# Altium project XC7A35.PrjPcb (part 1 of 5)
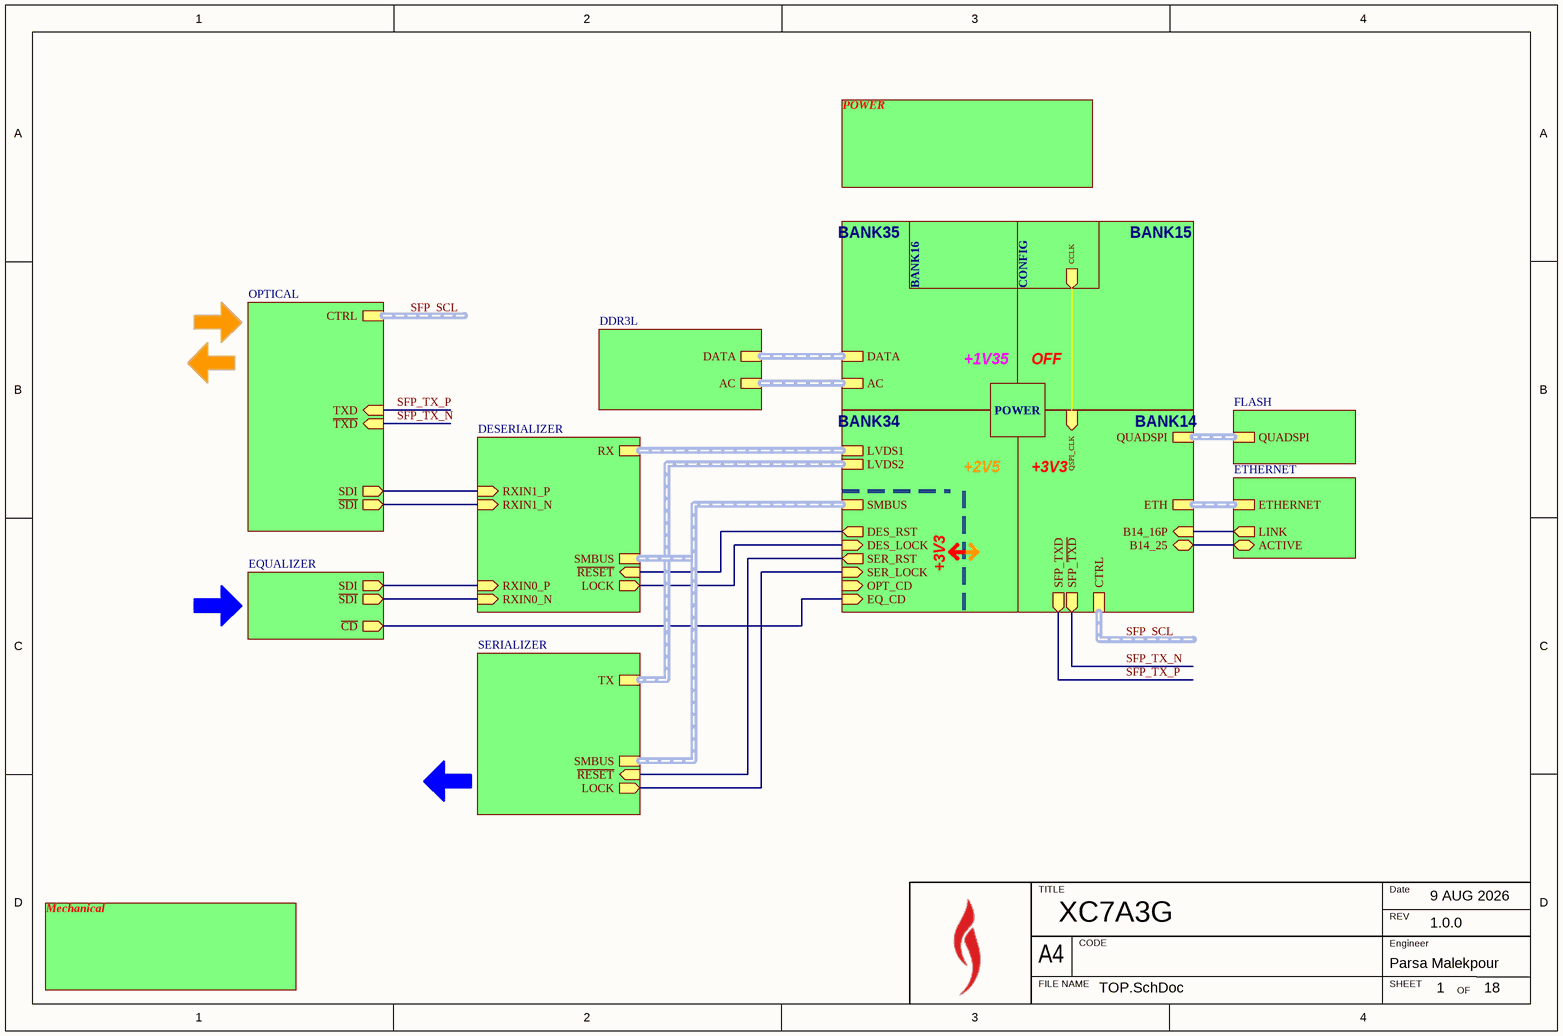
[diagram p0: TOP.SchDoc]
18 sheets, 322 parts. Net scope: hierarchical (ports join the sheet entries above them; power ports are global).
Board file: main.PcbDoc
Sheets:
  TOP.SchDoc
    BANK35 = BANK35.SchDoc
    DDR3L = DDR.SchDoc
    BANK14 = BANK14.SchDoc
    BANK15 = BANK15.SchDoc
    BANK34 = BANK34.SchDoc
    BANK16 = BANK16.SchDoc
    ETHERNET = ETHERNET.SchDoc
    EQUALIZER = EQULIZER.SchDoc
    DESERIALIZER = DESERILIZER.SchDoc
    SERIALIZER = SERIALIZER.SchDoc
    OPTICAL = OPTICS.SchDoc
    POWER = FPGA PWR.SchDoc
    CONFIG = FPGA CONFIG.SchDoc
    FLASH = FLASH.SchDoc
    POWER = POWER.SchDoc
    Mechanical = Mechanical.SchDoc
  Power Diagram.SchDoc

## Sheet TOP.SchDoc: XC7A3G
size A4; Date: 9 AUG 2026; Engineer: Parsa Malekpour; Revision: 1.0.0; SheetNumber: 1; SheetTotal: 18

### Sub-sheets
BANK14 = BANK14.SchDoc: ETH (harness ETHERNET), B14_25 (bidir), B14_16P (in), QUADSPI (harness QUADSPI), QSPI_CLK (in), CTRL (harness SFP_CTRL), SFP_TXD (out), SFP_~{TXD} (out)
BANK15 = BANK15.SchDoc: no entries
BANK16 = BANK16.SchDoc: no entries
BANK34 = BANK34.SchDoc: LVDS1 (harness LVDS), LVDS2 (harness LVDS), SMBUS (harness SMBUS), SER_LOCK (in), OPT_CD (in), DES_RST (out), DES_LOCK (in), SER_RST (out), EQ_CD (in)
BANK35 = BANK35.SchDoc: DATA (harness DDR3_DATA), AC (harness DDR3_AC)
CONFIG = FPGA CONFIG.SchDoc: CCLK (out)
DDR3L = DDR.SchDoc: DATA (harness DDR3_DATA), AC (harness DDR3_AC)
DESERIALIZER = DESERILIZER.SchDoc: RXIN0_N (in), RXIN0_P (in), RXIN1_N (in), RXIN1_P (in), RX (harness LVDS), ~{RESET} (in), LOCK (out), SMBUS (harness SMBUS)
EQUALIZER = EQULIZER.SchDoc: SDI (out), ~{SDI} (out), ~{CD} (out)
ETHERNET = ETHERNET.SchDoc: ETHERNET (harness ETHERNET), LINK (out), ACTIVE (bidir)
FLASH = FLASH.SchDoc: QUADSPI (harness QUADSPI)
Mechanical = Mechanical.SchDoc: no entries
OPTICAL = OPTICS.SchDoc: SDI (out), ~{SDI} (out), CTRL (harness SFP_CTRL), ~{TXD} (in), TXD (in)
POWER = FPGA PWR.SchDoc: no entries
POWER = POWER.SchDoc: no entries
SERIALIZER = SERIALIZER.SchDoc: ~{RESET} (in), TX (harness LVDS), LOCK (out), SMBUS (harness SMBUS)

### Nets
B14_25: sheet BANK14/B14_25, sheet ETHERNET/ACTIVE
DES_LOCK: sheet BANK34/DES_LOCK, sheet DESERIALIZER/LOCK
DES_~{RESET}: sheet BANK34/DES_RST, sheet DESERIALIZER/~{RESET}
EQ_~{CD}: sheet BANK34/EQ_CD, sheet EQUALIZER/~{CD}
EQ_SDO_N: sheet EQUALIZER/~{SDI}, sheet DESERIALIZER/RXIN0_N
EQ_SDO_P: sheet EQUALIZER/SDI, sheet DESERIALIZER/RXIN0_P
ETH_LINK: sheet BANK14/B14_16P, sheet ETHERNET/LINK
OPTIC_TD_N: sheet DESERIALIZER/RXIN1_N, sheet OPTICAL/~{SDI}
OPTIC_TD_P: sheet DESERIALIZER/RXIN1_P, sheet OPTICAL/SDI
SER_LOCK: sheet BANK34/SER_LOCK, sheet SERIALIZER/LOCK
SER_~{RESET}: sheet BANK34/SER_RST, sheet SERIALIZER/~{RESET}
SFP_TX_N: sheet BANK14/SFP_~{TXD}, sheet OPTICAL/~{TXD}
SFP_TX_P: sheet BANK14/SFP_TXD, sheet OPTICAL/TXD
SPI_SCK: sheet BANK14/QSPI_CLK, sheet CONFIG/CCLK

### Buses and harness runs
harness SFP_SCL = sheet BANK14/CTRL
harness SFP_SCL = sheet OPTICAL/CTRL
harness sheet BANK14/ETH = sheet ETHERNET/ETHERNET
harness sheet BANK14/QUADSPI = sheet FLASH/QUADSPI
harness sheet BANK34/LVDS1 = sheet DESERIALIZER/RX
harness sheet BANK34/LVDS2 = sheet SERIALIZER/TX
harness sheet BANK34/SMBUS = sheet DESERIALIZER/SMBUS = sheet SERIALIZER/SMBUS
harness sheet BANK35/AC = sheet DDR3L/AC
harness sheet BANK35/DATA = sheet DDR3L/DATA

### Notes on the sheet
- +1V35
- OFF
- +2V5
- +3V3
- TITLE
- REV
- Date
- A4
- FILE NAME
- CODE
- SHEET
- Engineer
- OF

## Sheet BANK35.SchDoc: XC7A3G-BANK35
size A4; Date: 9 AUG 2026; Engineer: Parsa Malekpour; Revision: 1.0.0; SheetNumber: 6; SheetTotal: 18
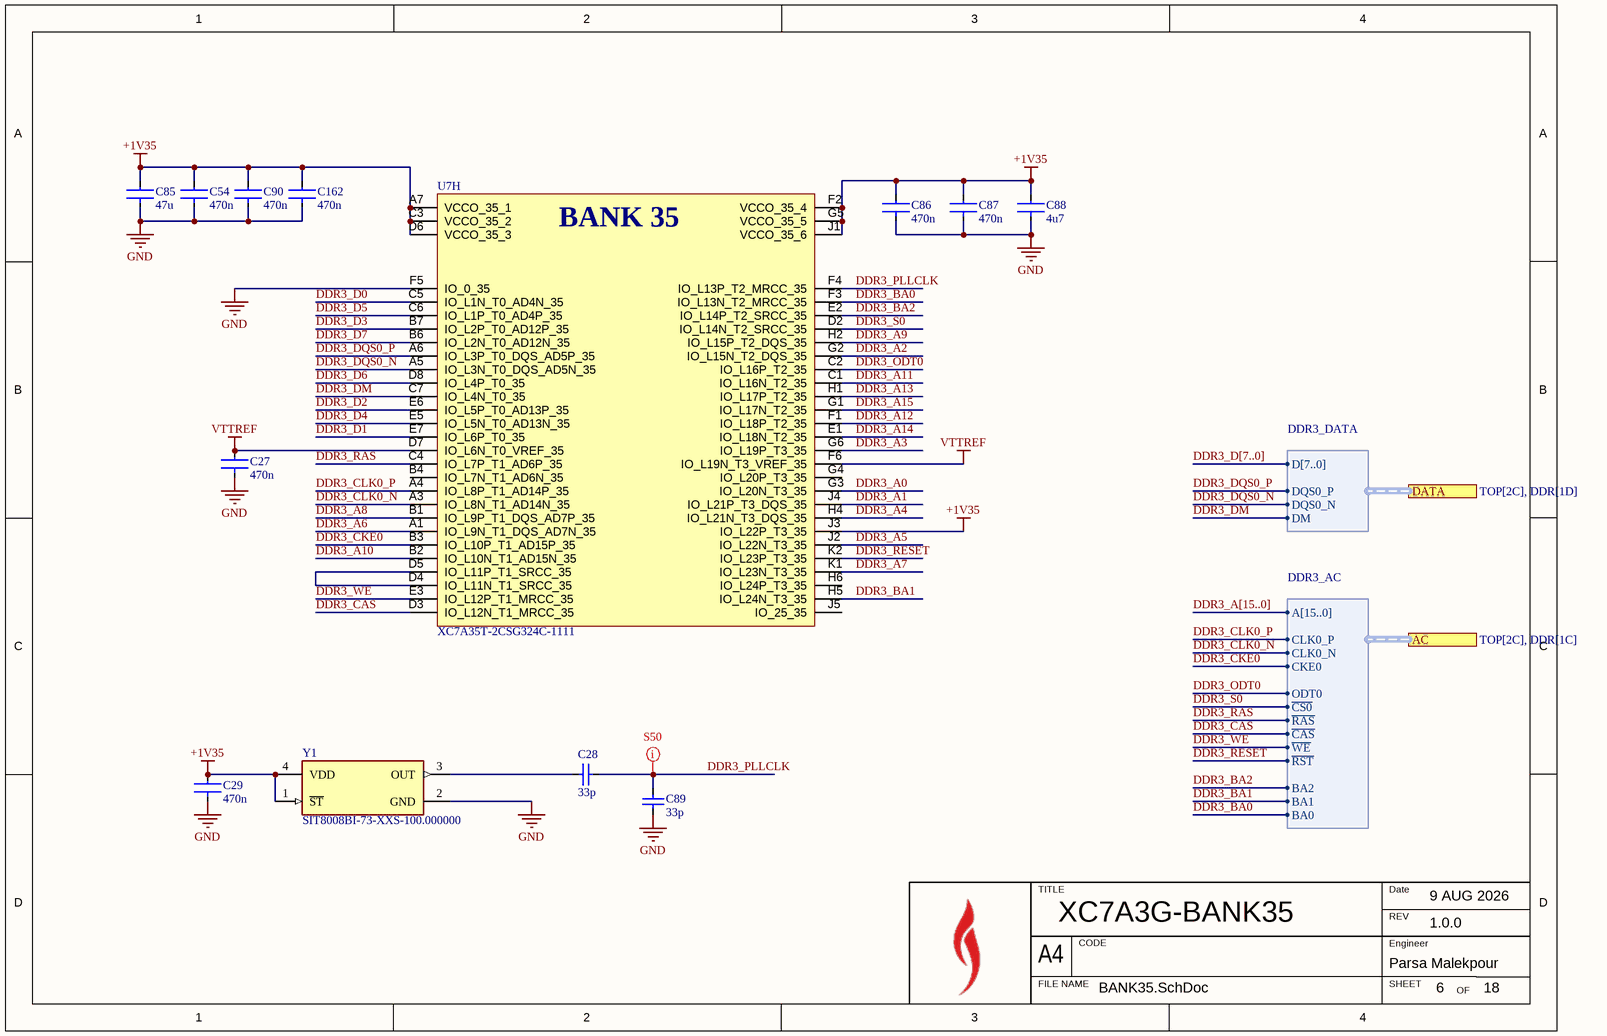
[diagram p1: BANK35.SchDoc]

### Parts
C27  value 470n  [FP-C1005-050-0_05-IPC_C]  (hidden comment: C1005X5R1E474K050BB)
C28  value 33p  [FP-C1005-050-0_05-IPC_C]  (hidden comment: C1005NP01H330J050BA)
C29  value 470n  [FP-C1005-050-0_05-IPC_C]  (hidden comment: C1005X5R1E474K050BB)
C54  value 470n  [FP-C1005-050-0_05-IPC_C]  (hidden comment: C1005X5R1E474K050BB)
C85  value 47u  [FP-C2012-125-0_2-IPC_C]  (hidden comment: C2012X5R1A476M125AC)
C86  value 470n  [FP-C1005-050-0_05-IPC_C]  (hidden comment: C1005X5R1E474K050BB)
C87  value 470n  [FP-C1005-050-0_05-IPC_C]  (hidden comment: C1005X5R1E474K050BB)
C88  value 4u7  [FP-C1005-050-0_20-0_10-IPC_C]  (hidden comment: C1005X5R1A475K050BE)
C89  value 33p  [FP-C1005-050-0_05-IPC_C]  (hidden comment: C1005NP01H330J050BA)
C90  value 470n  [FP-C1005-050-0_05-IPC_C]  (hidden comment: C1005X5R1E474K050BB)
C162  value 470n  [FP-C1005-050-0_05-IPC_C]  (hidden comment: C1005X5R1E474K050BB)
U7  XC7A35T-2CSG324C-1111  [BGA324C80P18X18_1500X1500X150]  (part H of 8)
Y1  SIT8008BI-73-XXS-100.000000  [FP-SiT8008-7-MFG]

### Ports
AC (harness DDR3_AC, see TOP[2C], DDR[1C]), DATA (harness DDR3_DATA, see TOP[2C], DDR[1D])

### Harnesses
DDR3_DATA: D[7..0], DQS0_P, DM, DQS0_N
DDR3_AC: A[15..0], CLK0_P, CKE0, CLK0_N, ODT0, ~{CS0}, ~{RAS}, ~{WE}, ~{CAS}, ~{RST}, BA2, BA1, BA0

### Nets
+1V35: C29.2 C54.2 C85.2 C86.2 C87.2 C88.2 C90.2 C162.2 U7.A7(VCCO_35_1) U7.C3(VCCO_35_2) U7.D6(VCCO_35_3) U7.F2(VCCO_35_4) U7.G5(VCCO_35_5) U7.J1(VCCO_35_6) U7.J3(IO_L22P_T3_35) Y1.1(~{ST}) Y1.4(VDD)
GND: C27.1 C29.1 C54.1 C85.1 C86.1 C87.1 C88.1 C89.1 C90.1 C162.1 U7.F5(IO_0_35) Y1.2(GND)
VTTREF: C27.2 U7.D7(IO_L6N_T0_VREF_35) U7.F6(IO_L19N_T3_VREF_35)
DDR3_A0: U7.G3(IO_L20N_T3_35)
DDR3_A1: U7.J4(IO_L21P_T3_DQS_35)
DDR3_A2: U7.G2(IO_L15N_T2_DQS_35)
DDR3_A3: U7.G6(IO_L19P_T3_35)
DDR3_A4: U7.H4(IO_L21N_T3_DQS_35)
DDR3_A5: U7.J2(IO_L22N_T3_35)
DDR3_A6: U7.A1(IO_L9N_T1_DQS_AD7N_35)
DDR3_A7: U7.K1(IO_L23N_T3_35)
DDR3_A8: U7.B1(IO_L9P_T1_DQS_AD7P_35)
DDR3_A9: U7.H2(IO_L15P_T2_DQS_35)
DDR3_A10: U7.B2(IO_L10N_T1_AD15N_35)
DDR3_A11: U7.C1(IO_L16N_T2_35)
DDR3_A12: U7.F1(IO_L18P_T2_35)
DDR3_A13: U7.H1(IO_L17P_T2_35)
DDR3_A14: U7.E1(IO_L18N_T2_35)
DDR3_A15: U7.G1(IO_L17N_T2_35)
DDR3_BA0: U7.F3(IO_L13N_T2_MRCC_35) ; port AC.BA0
DDR3_BA1: U7.H5(IO_L24N_T3_35) ; port AC.BA1
DDR3_BA2: U7.E2(IO_L14P_T2_SRCC_35) ; port AC.BA2
DDR3_CAS: U7.D3(IO_L12N_T1_MRCC_35) ; port AC.~{CAS}
DDR3_CKE0: U7.B3(IO_L10P_T1_AD15P_35) ; port AC.CKE0
DDR3_CLK0_N: U7.A3(IO_L8N_T1_AD14N_35) ; port AC.CLK0_N
DDR3_CLK0_P: U7.A4(IO_L8P_T1_AD14P_35) ; port AC.CLK0_P
DDR3_D0: U7.C5(IO_L1N_T0_AD4N_35)
DDR3_D1: U7.E7(IO_L6P_T0_35)
DDR3_D2: U7.E6(IO_L5P_T0_AD13P_35)
DDR3_D3: U7.B7(IO_L2P_T0_AD12P_35)
DDR3_D4: U7.E5(IO_L5N_T0_AD13N_35)
DDR3_D5: U7.C6(IO_L1P_T0_AD4P_35)
DDR3_D6: U7.D8(IO_L4P_T0_35)
DDR3_D7: U7.B6(IO_L2N_T0_AD12N_35)
DDR3_DM: U7.C7(IO_L4N_T0_35) ; port DATA.DM
DDR3_DQS0_N: U7.A5(IO_L3N_T0_DQS_AD5N_35) ; port DATA.DQS0_N
DDR3_DQS0_P: U7.A6(IO_L3P_T0_DQS_AD5P_35) ; port DATA.DQS0_P
DDR3_ODT0: U7.C2(IO_L16P_T2_35) ; port AC.ODT0
DDR3_PLLCLK: C28.2 C89.2 U7.F4(IO_L13P_T2_MRCC_35)
DDR3_RAS: U7.C4(IO_L7P_T1_AD6P_35) ; port AC.~{RAS}
DDR3_RESET: U7.K2(IO_L23P_T3_35) ; port AC.~{RST}
DDR3_S0: U7.D2(IO_L14N_T2_SRCC_35) ; port AC.~{CS0}
DDR3_WE: U7.E3(IO_L12P_T1_MRCC_35) ; port AC.~{WE}
NetC28_1: C28.1 Y1.3(OUT)
NetU7_D4: U7.D4(IO_L11N_T1_SRCC_35) U7.D5(IO_L11P_T1_SRCC_35)

Not connected (* = marked no-connect by the designer): U7 B4(IO_L7N_T1_AD6N_35) G4(IO_L20P_T3_35) H6(IO_L24P_T3_35) J5(IO_25_35)

### Buses and harness runs
bus DDR3_A[15..0]
bus DDR3_D[7..0]

### Layout directives
net class S50: DDR3_PLLCLK

### Notes on the sheet
- TITLE
- REV
- Date
- A4
- FILE NAME
- CODE
- SHEET
- Engineer
- OF
- (in symbol XC7A35T-2CSG324C-1111, part H) BANK 35

### Library data of the parts
C27 C29 C54 C86 C87 C90 C162 = CMP-2000-06003-2: Multilayer Ceramic Capacitors 470nF ±10% 25V X5R SMD 0402; Dissipation Factor: 10%; Case Code (Metric): 1005; RoHS Compliant: Yes; Lead Free: Lead Free; Length: 1mm; Case/Package: 0402; Termination: SMD/SMT; Voltage Rating: 25V; Dielectric Material: Ceramic; Dielectric: X5R; Depth: 0.5mm; Series: C; Voltage: 25V; Tolerance: 10%; Packaging: Tape and Reel; Resistor Type: Ceramic; Min Operating Temperature: -55°C; Width: 0.02inch; Thickness: 500um; Package Quantity: 10000; Case Code (Imperial): 0402; Construction: Flat; Height: 0.5mm; REACH SVHC: No SVHC; Radiation Hardening: No; Weight: 2.3E-05oz; Mount: Surface Mount; Voltage Rating (DC): 25V; Max Operating Temperature: 85°C; Part Number: C1005X5R1E474K050BB
C28 C89 = C1005NP01H330J050BA: Multilayer Ceramic Capacitors 33pF ±5% 50V NP0 SMD 0402; Dielectric: C0G; Case Code (Imperial): 0402; Thickness: 0.022inch; Width: 0.02inch; Case Code (Metric): 1005; Length: 0.039inch; Voltage Rating (DC): 50V; Mount: Surface Mount; Max Operating Temperature: 150°C; Height: 0.5mm; Weight: 2.3E-05oz; Voltage Rating: 50V; Case/Package: 0402; Features: High Temperature; Termination: SMD/SMT; Package Quantity: 10000; RoHS Compliant: Yes; Series: C; Tolerance: 5%; Min Operating Temperature: -55°C; Packaging: Tape and Reel; Part Number: C1005NP01H330J050BA
C85 = CMP-2000-05451-2: Multilayer Ceramic Capacitors 47μF ±20% 10V X5R SMD 0805; RoHS Compliant: Yes; Dielectric: X5R; Case Code (Imperial): 0805; Min Operating Temperature: -55°C; Length: 2mm; Voltage Rating: 10V; Lead Free: Lead Free; Weight: 0.000194oz; Resistor Type: Ceramic; Dielectric Material: Ceramic; Max Operating Temperature: 85°C; Height: 1.25mm; Width: 0.049inch; Depth: 1.25mm; Termination: SMD/SMT; Case/Package: 0805; Voltage Rating (DC): 10V; Voltage: 10V; Thickness: 0.057inch; Tolerance: 20%; REACH SVHC: No SVHC; Package Quantity: 1; Series: C; Case Code (Metric): 2012; Mount: Surface Mount; Packaging: Tape and Reel; Part Number: C2012X5R1A476M125AC
C88 = CMP-08246-007228-1: CAP CER 4.7UF 10V X5R 0402; Tolerance: 10%; Max Operating Temperature: 85°C; Case Code (Metric): 1005; Voltage Rating: 10V; Packaging: Tape and Reel; Case/Package: 0402; Features: Soft Termination; Min Operating Temperature: -55°C; Mount: Surface Mount; Case Code (Imperial): 0402; RoHS Compliant: Yes; Part Number: C1005X5R1A475K050BE
U7 = XC7A35T-2CSG324C-1111: Integrated Circuit; Manufacturer_Name: AMD; Datasheet Link: https://www.xilinx.com/support/documentation/data_sheets/ds181_Artix_7_Data_Sheet.pdf; Height: 1.5mm; Manufacturer_Part_Number: XC7A35T-2CSG324C; Mouser Part Number: 217-XC7A35T-2CSG324C; Mouser Price/Stock: https://www.mouser.co.uk/ProductDetail/AMD-Xilinx/XC7A35T-2CSG324C?qs=rrS6PyfT74fMA9%2F3WtPZmw%3D%3D
Y1 = SIT8008BI-73-XXS-100.000000: MEMS OSC XO 100.0000MHZ HCMOS

## Sheet DDR.SchDoc: XC7A3G-LDDR3
size A4; Date: 9 AUG 2026; Engineer: Parsa Malekpour; Revision: 1.0.0; SheetNumber: 10; SheetTotal: 18
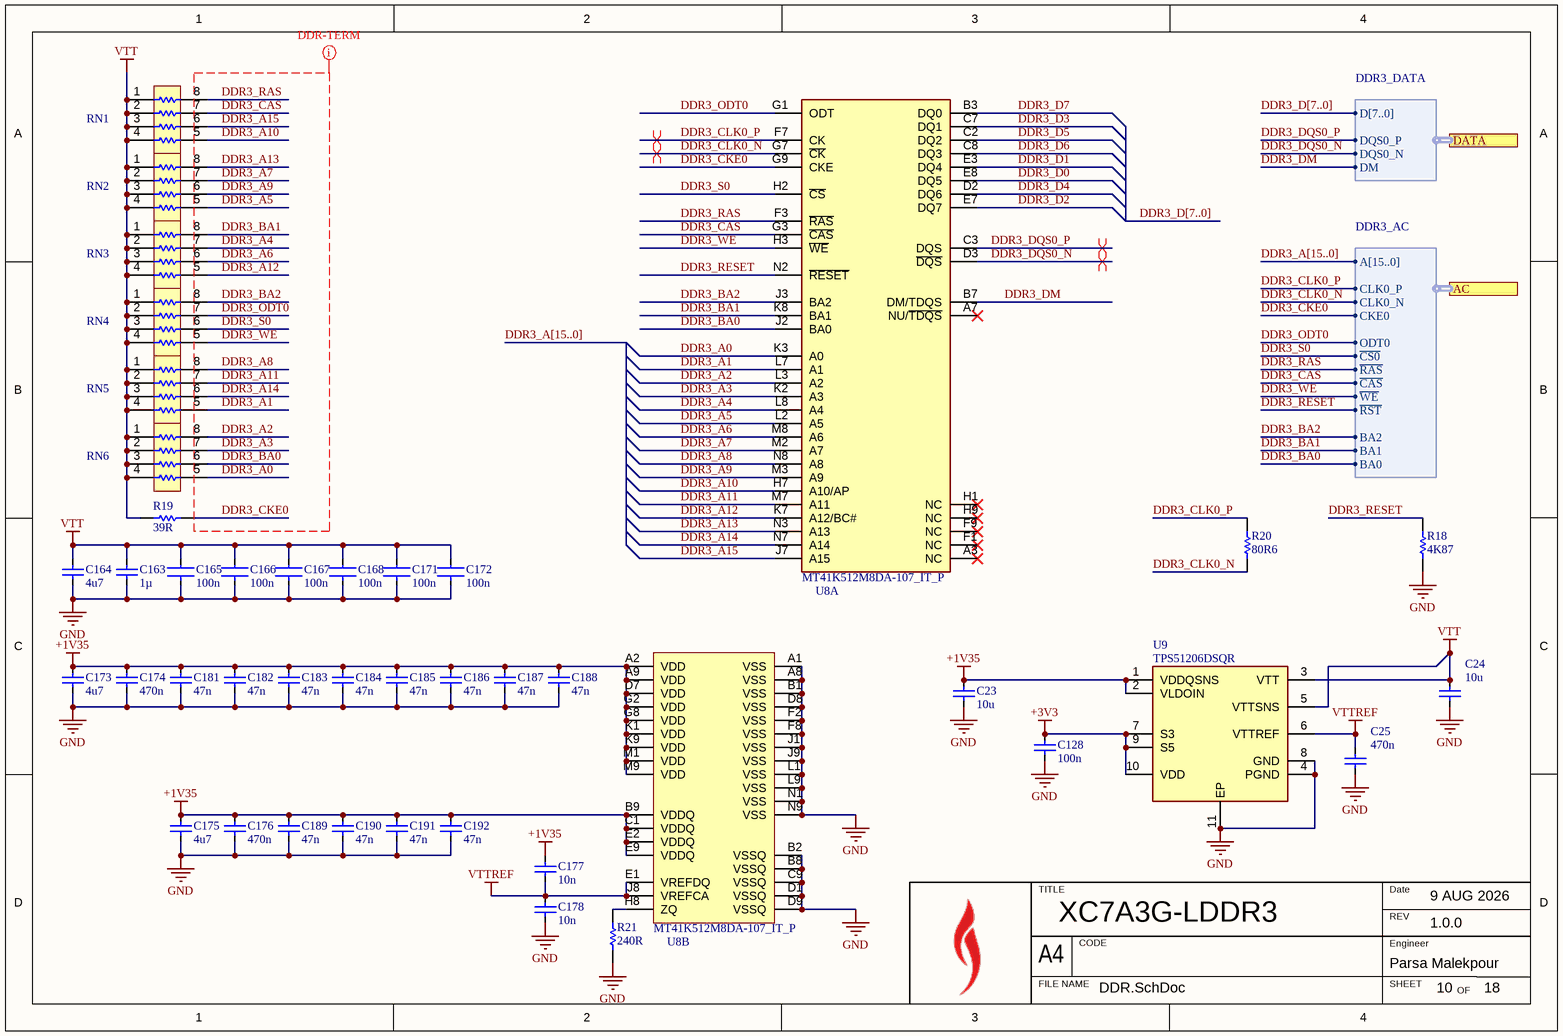
[diagram p2: DDR.SchDoc]

### Parts
C23  value 10u  [FP-C1608-080-0_1-IPC_C]  (hidden comment: C1608JB0J106K080AB)
C24  value 10u  [FP-C1608-080-0_1-IPC_C]  (hidden comment: C1608JB0J106K080AB)
C25  value 470n  [FP-C1005-050-0_05-IPC_C]  (hidden comment: C1005X5R1E474K050BB)
C128  value 100n  [FP-C1005-050-0_05-IPC_C]  (hidden comment: C1005X7R1H104K050BB)
C163  value 1µ  [CAPC1005X55X10NL05]  (hidden comment: C1005X5R1A105K050BB)
C164  value 4u7  [FP-C1005-050-0_20-0_10-IPC_C]  (hidden comment: C1005X5R1A475K050BE)
C165  value 100n  [FP-C1005-050-0_05-IPC_C]  (hidden comment: C1005X7R1H104K050BB)
C166  value 100n  [FP-C1005-050-0_05-IPC_C]  (hidden comment: C1005X7R1H104K050BB)
C167  value 100n  [FP-C1005-050-0_05-IPC_C]  (hidden comment: C1005X7R1H104K050BB)
C168  value 100n  [FP-C1005-050-0_05-IPC_C]  (hidden comment: C1005X7R1H104K050BB)
C171  value 100n  [FP-C1005-050-0_05-IPC_C]  (hidden comment: C1005X7R1H104K050BB)
C172  value 100n  [FP-C1005-050-0_05-IPC_C]  (hidden comment: C1005X7R1H104K050BB)
C173  value 4u7  [FP-C1005-050-0_20-0_10-IPC_C]  (hidden comment: C1005X5R1A475K050BE)
C174  value 470n  [FP-C1005-050-0_05-IPC_C]  (hidden comment: C1005X5R1E474K050BB)
C175  value 4u7  [FP-C1005-050-0_20-0_10-IPC_C]  (hidden comment: C1005X5R1A475K050BE)
C176  value 470n  [FP-C1005-050-0_05-IPC_C]  (hidden comment: C1005X5R1E474K050BB)
C177  value 10n  [FP-C1005-050-0_05-IPC_C]  (hidden comment: C1005X7S2A103K050BB)
C178  value 10n  [FP-C1005-050-0_05-IPC_C]  (hidden comment: C1005X7S2A103K050BB)
C181  value 47n  [FP-C1005-050-0_05-IPC_C]  (hidden comment: C1005X7R1H473K050BB)
C182  value 47n  [FP-C1005-050-0_05-IPC_C]  (hidden comment: C1005X7R1H473K050BB)
C183  value 47n  [FP-C1005-050-0_05-IPC_C]  (hidden comment: C1005X7R1H473K050BB)
C184  value 47n  [FP-C1005-050-0_05-IPC_C]  (hidden comment: C1005X7R1H473K050BB)
C185  value 47n  [FP-C1005-050-0_05-IPC_C]  (hidden comment: C1005X7R1H473K050BB)
C186  value 47n  [FP-C1005-050-0_05-IPC_C]  (hidden comment: C1005X7R1H473K050BB)
C187  value 47n  [FP-C1005-050-0_05-IPC_C]  (hidden comment: C1005X7R1H473K050BB)
C188  value 47n  [FP-C1005-050-0_05-IPC_C]  (hidden comment: C1005X7R1H473K050BB)
C189  value 47n  [FP-C1005-050-0_05-IPC_C]  (hidden comment: C1005X7R1H473K050BB)
C190  value 47n  [FP-C1005-050-0_05-IPC_C]  (hidden comment: C1005X7R1H473K050BB)
C191  value 47n  [FP-C1005-050-0_05-IPC_C]  (hidden comment: C1005X7R1H473K050BB)
C192  value 47n  [FP-C1005-050-0_05-IPC_C]  (hidden comment: C1005X7R1H473K050BB)
R18  value 4K87  [RESC1005X40X25LL05T10]  (hidden comment: RC0402FR-074K87L)
R19  value 39R  [RESC1005X40X25LL05T10]  (hidden comment: RC0402FR-0739RL)
R20  value 80R6  [RESC1005X40X25LL05T10]  (hidden comment: RC0402FR-0780R6L)
R21  value 240R  [RESC1005X40X25LL05T10]  (hidden comment: RC0402FR-07240RL)
RN1  (no value)  [TC124FR0739RL]
RN2  (no value)  [TC124FR0739RL]
RN3  (no value)  [TC124FR0739RL]
RN4  (no value)  [TC124FR0739RL]
RN5  (no value)  [TC124FR0739RL]
RN6  (no value)  [TC124FR0739RL]
U8  MT41K512M8DA-107_IT_P  [BGA78C80P9X13_800X1050X120]  (parts A,B of 2)
U9  TPS51206DSQR  [SON40P200X200X80-11N]

### Ports
AC (harness DDR3_AC, see TOP[3C], BANK35[1B]), DATA (harness DDR3_DATA, see TOP[3C], BANK35[1C])

### Harnesses
DDR3_DATA: D[7..0], DQS0_P, DM, DQS0_N
DDR3_AC: A[15..0], CLK0_P, CKE0, CLK0_N, ODT0, ~{CS0}, ~{RAS}, ~{WE}, ~{CAS}, ~{RST}, BA2, BA1, BA0

### Nets
+1V35: C23.1 C173.1 C174.1 C175.1 C176.1 C177.1 C181.1 C182.1 C183.1 C184.1 C185.1 C186.1 C187.1 C188.1 C189.1 C190.1 C191.1 C192.1 U8.A2(VDD) U8.A9(VDD) U8.B9(VDDQ) U8.C1(VDDQ) U8.D7(VDD) U8.E2(VDDQ) U8.E9(VDDQ) U8.G2(VDD) U8.G8(VDD) U8.K1(VDD) U8.K9(VDD) U8.M1(VDD) U8.M9(VDD) U9.1(VDDQSNS) U9.2(VLDOIN)
+3V3: C128.1 U9.7(S3) U9.9(S5) U9.10(VDD)
GND: C23.2 C24.1 C25.1 C128.2 C163.2 C164.2 C165.1 C166.1 C167.1 C168.1 C171.1 C172.1 C173.2 C174.2 C175.2 C176.2 C178.2 C181.2 C182.2 C183.2 C184.2 C185.2 C186.2 C187.2 C188.2 C189.2 C190.2 C191.2 C192.2 R18.1 R21.2 U8.A1(VSS) U8.A8(VSS) U8.B1(VSS) U8.B2(VSSQ) U8.B8(VSSQ) U8.C9(VSSQ) U8.D1(VSSQ) U8.D8(VSS) U8.D9(VSSQ) U8.F2(VSS) U8.F8(VSS) U8.J1(VSS) U8.J9(VSS) U8.L1(VSS) U8.L9(VSS) U8.N1(VSS) U8.N9(VSS) U9.4(PGND) U9.8(GND) U9.11(EP)
VTT: C24.2 C163.1 C164.1 C165.2 C166.2 C167.2 C168.2 C171.2 C172.2 R19.1 RN1.1 RN1.2 RN1.3 RN1.4 RN2.1 RN2.2 RN2.3 RN2.4 RN3.1 RN3.2 RN3.3 RN3.4 RN4.1 RN4.2 RN4.3 RN4.4 RN5.1 RN5.2 RN5.3 RN5.4 RN6.1 RN6.2 RN6.3 RN6.4 U9.3(VTT) U9.5(VTTSNS)
VTTREF: C25.2 C177.2 C178.1 U8.E1(VREFDQ) U8.J8(VREFCA) U9.6(VTTREF)
DDR3_A0: RN6.5 U8.K3(A0)
DDR3_A1: RN5.5 U8.L7(A1)
DDR3_A2: RN6.8 U8.L3(A2)
DDR3_A3: RN6.7 U8.K2(A3)
DDR3_A4: RN3.7 U8.L8(A4)
DDR3_A5: RN2.5 U8.L2(A5)
DDR3_A6: RN3.6 U8.M8(A6)
DDR3_A7: RN2.7 U8.M2(A7)
DDR3_A8: RN5.8 U8.N8(A8)
DDR3_A9: RN2.6 U8.M3(A9)
DDR3_A10: RN1.5 U8.H7(A10/AP)
DDR3_A11: RN5.7 U8.M7(A11)
DDR3_A12: RN3.5 U8.K7(A12/BC#)
DDR3_A13: RN2.8 U8.N3(A13)
DDR3_A14: RN5.6 U8.N7(A14)
DDR3_A15: RN1.6 U8.J7(A15)
DDR3_BA0: RN6.6 U8.J2(BA0) ; port AC.BA0
DDR3_BA1: RN3.8 U8.K8(BA1) ; port AC.BA1
DDR3_BA2: RN4.8 U8.J3(BA2) ; port AC.BA2
DDR3_CAS: RN1.7 U8.G3(~{CAS}) ; port AC.~{CAS}
DDR3_CKE0: R19.2 U8.G9(CKE) ; port AC.CKE0
DDR3_CLK0_N: R20.2 U8.G7(~{CK}) ; port AC.CLK0_N
DDR3_CLK0_P: R20.1 U8.F7(CK) ; port AC.CLK0_P
DDR3_D0: U8.E8(DQ5)
DDR3_D1: U8.E3(DQ4)
DDR3_D2: U8.E7(DQ7)
DDR3_D3: U8.C7(DQ1)
DDR3_D4: U8.D2(DQ6)
DDR3_D5: U8.C2(DQ2)
DDR3_D6: U8.C8(DQ3)
DDR3_D7: U8.B3(DQ0)
DDR3_DM: U8.B7(DM/TDQS) ; port DATA.DM
DDR3_DQS0_N: U8.D3(~{DQS}) ; port DATA.DQS0_N
DDR3_DQS0_P: U8.C3(DQS) ; port DATA.DQS0_P
DDR3_ODT0: RN4.7 U8.G1(ODT) ; port AC.ODT0
DDR3_RAS: RN1.8 U8.F3(~{RAS}) ; port AC.~{RAS}
DDR3_RESET: R18.2 U8.N2(~{RESET}) ; port AC.~{RST}
DDR3_S0: RN4.6 U8.H2(~{CS}) ; port AC.~{CS0}
DDR3_WE: RN4.5 U8.H3(~{WE}) ; port AC.~{WE}
NetR21_1: R21.1 U8.H8(ZQ)

Not connected (* = marked no-connect by the designer): U8 A3(NC)* A7(NU/~{TDQS})* F1(NC)* F9(NC)* H1(NC)* H9(NC)*

### Buses and harness runs
bus DDR3_A[15..0]
bus DDR3_D[7..0]

### Layout directives
differential pair: DDR3_CLK0_N, DDR3_CLK0_P, DDR3_DQS0_N, DDR3_DQS0_P
net class DDR-TERM: DDR3_A0, DDR3_A1, DDR3_A2, DDR3_A3, DDR3_A4, DDR3_A5, DDR3_A6, DDR3_A7, DDR3_A8, DDR3_A9, DDR3_A10, DDR3_A11, DDR3_A12, DDR3_A13, DDR3_A14, DDR3_A15, DDR3_BA0, DDR3_BA1, DDR3_BA2, DDR3_CAS, DDR3_CKE0, DDR3_ODT0, DDR3_RAS, DDR3_S0, DDR3_WE

### Notes on the sheet
- TITLE
- REV
- Date
- A4
- FILE NAME
- CODE
- SHEET
- Engineer
- OF

### Library data of the parts
C23 C24 = C1608JB0J106K080AB: MLCC 10μF ±10% 6.3V JB SMD 0603; Dielectric Material: Ceramic; Case Code (Imperial): 0603; Thickness: 0.035inch; Min Operating Temperature: -25°C; Termination: SMD/SMT; Lead Free: Lead Free; Resistor Type: Ceramic; Width: 0.8mm; Voltage Rating (DC): 6.3V; Package Quantity: 4000; Tolerance: 10%; Length: 0.063inch; Series: C; Height: 0.8mm; Max Operating Temperature: 85°C; Mount: Surface Mount; RoHS Compliant: Yes; Voltage Rating: 6.3V; Case Code (Metric): 1608; Case/Package: 0603; Packaging: Tape and Reel
C25 = C1005X5R1E474K050BB: MLCC 470nF ±10% 25V X5R SMD 0402; Dielectric Material: Ceramic; Dissipation Factor: 10%; Case Code (Metric): 1005; RoHS Compliant: Yes; Lead Free: Lead Free; Length: 1mm; Case/Package: 0402; Termination: SMD/SMT; Voltage Rating: 25V; Dielectric: X5R; Depth: 0.5mm; Series: C; Voltage: 25V; Tolerance: 10%; Packaging: Tape and Reel; Resistor Type: Ceramic; Min Operating Temperature: -55°C; Width: 0.02inch; Thickness: 500um; Package Quantity: 10000; Case Code (Imperial): 0402; Construction: Flat; Height: 0.5mm; REACH SVHC: No SVHC; Radiation Hardening: No; Weight: 2.3E-05oz; Mount: Surface Mount; Voltage Rating (DC): 25V; Max Operating Temperature: 85°C; Part Number: C1005X5R1E474K050BB
C128 = C1005X7R1H104K050BB: MLCC 100nF ±10% 50V X7R SMD 0402; Dielectric Material: Ceramic; Voltage: 50V; Min Operating Temperature: -55°C; Depth: 0.5mm; Radiation Hardening: No; RoHS Compliant: Yes; Voltage Rating (DC): 50V; Lead Free: Lead Free; Resistor Type: Ceramic; Height: 0.5mm; Dielectric: X7R; Thickness: 0.022inch; Case/Package: 0402; Case Code (Metric): 1005; Termination: SMD/SMT; Packaging: Tape and Reel; Max Operating Temperature: 125°C; Mount: Surface Mount; Package Quantity: 1; Width: 0.02inch; Weight: 2.3E-05oz; Voltage Rating: 50V; Tolerance: 10%; Construction: Flat; Case Code (Imperial): 0402; Length: 1mm; REACH SVHC: No SVHC; Series: C; Part Number: C1005X7R1H104K050BB
C163 = C1005X5R1A105K050BB: Multilayer Ceramic Chip Capacitor, 1 uF, +/- 10%, 10 V, -55 to 85 degC, 0402 (1005 Metric), RoHS, Tape and Reel; Manufacturer: TDK; PCN Part Number: MLCCPartNumberChange30/Nov/2012; Product Training Modules: CSeriesGeneralApplicationsSEAT,CCV,andTVCLDesignToolsGuidetoReplacinganElectrolyticCapacitorwithanMLCC; Voltage - Rated: 10V; Temperature Coefficient: X5R; Online Catalog: CSeries,GeneralPurpose; Other Names: 445-4114-6; Category: Capacitors; Features: -; Lead Style: -; RoHS Information: RoHSCertificate-MLCC; Manufacturer URL: http://www.tdk.com/; Lead Spacing: -; Thickness (Max): 0.022"(0.55mm); Applications: GeneralPurpose; Tolerance: ±10%; Mounting Technology: SurfaceMount; Mounting Type: SurfaceMount,MLCC; Operating Temperature: -55°C~85°C; Datasheet URL: http://download.siliconexpert.com/pdfs/2015/4/21/15/54/45/779/tdk_/manual/37024850441143360mlcc_commercial_general_en.pdf; Package Reference: 1005; Height - Seated (Max): -; Family: CeramicCapacitors; Datasheet Version: 03/2015; Package Description: 2-Pin Surface Mount Device, Body 1 x 0.5 mm; Packaging: Digi-Reel®; Size / Dimension: 0.039"Lx0.020"W(1.00mmx0.50mm); Standard Package: 1; Package / Case: 0402(1005Metric); Ratings: -; Series: C; Part Number: C1005X5R1A105K050BB
C164 C173 C175 = C1005X5R1A475K050BE: CAP CER 4.7UF 10V X5R 0402; Tolerance: 10%; Max Operating Temperature: 85°C; Case Code (Metric): 1005; Voltage Rating: 10V; Packaging: Tape and Reel; Case/Package: 0402; Features: Soft Termination; Min Operating Temperature: -55°C; Mount: Surface Mount; Case Code (Imperial): 0402; RoHS Compliant: Yes; Part Number: C1005X5R1A475K050BE
C165-C168 C171 C172 = CMP-2000-05393-2: Multilayer Ceramic Capacitors 100nF ±10% 50V X7R SMD 0402; Voltage: 50V; Dielectric Material: Ceramic; Min Operating Temperature: -55°C; Depth: 0.5mm; Radiation Hardening: No; RoHS Compliant: Yes; Voltage Rating (DC): 50V; Lead Free: Lead Free; Resistor Type: Ceramic; Height: 0.5mm; Dielectric: X7R; Thickness: 0.022inch; Case/Package: 0402; Case Code (Metric): 1005; Termination: SMD/SMT; Packaging: Tape and Reel; Max Operating Temperature: 125°C; Mount: Surface Mount; Package Quantity: 1; Width: 0.02inch; Weight: 2.3E-05oz; Voltage Rating: 50V; Tolerance: 10%; Construction: Flat; Case Code (Imperial): 0402; Length: 1mm; REACH SVHC: No SVHC; Series: C; Part Number: C1005X7R1H104K050BB
C174 C176 = C1005X5R1E474K050BB: Multilayer Ceramic Capacitors 470nF ±10% 25V X5R SMD 0402; Dissipation Factor: 10%; Case Code (Metric): 1005; RoHS Compliant: Yes; Lead Free: Lead Free; Length: 1mm; Case/Package: 0402; Termination: SMD/SMT; Dielectric Material: Ceramic; Dielectric: X5R; Depth: 0.5mm; Series: C; Voltage: 25V; Tolerance: 10%; Packaging: Tape and Reel; Resistor Type: Ceramic; Min Operating Temperature: -55°C; Width: 0.02inch; Thickness: 500um; Package Quantity: 10000; Case Code (Imperial): 0402; Construction: Flat; Height: 0.5mm; REACH SVHC: No SVHC; Radiation Hardening: No; Weight: 2.3E-05oz; Mount: Surface Mount; Voltage Rating (DC): 25V; Max Operating Temperature: 85°C; Part Number: C1005X5R1E474K050BB; Voltage Rating: 25V
C177 C178 = C1005X7S2A103K050BB: Multilayer Ceramic Capacitors 10nF ±10% 100V X7S SMD 0402; Dissipation Factor: 5%; Case Code (Imperial): 0402; Packaging: Tape and Reel; Voltage Rating (DC): 100V; Max Operating Temperature: 125°C; Min Operating Temperature: -55°C; Case Code (Metric): 1005; Weight: 2.3E-05oz; Length: 1mm; Width: 0.02inch; Tolerance: 10%; Series: C; Package Quantity: 1; RoHS Compliant: Yes; Voltage: 100V; Resistor Type: Ceramic; Number of Pins: 2; Mount: Surface Mount; Height: 0.5mm; Termination: SMD/SMT; Dielectric: X7S; Dielectric Material: Ceramic; Thickness: 0.022inch; REACH SVHC: No SVHC; Lead Free: Lead Free; Voltage Rating: 100V; Case/Package: 0402; Depth: 0.5mm; Part: *; Part Number: C1005X7S2A103K050BB
C181-C192 = C1005X7R1H473K050BB: Multilayer Ceramic Capacitors 47nF ±10% 50V X7R SMD 0402; Dissipation Factor: 5%; Weight: 2.3E-05oz; Max Operating Temperature: 125°C; Package Quantity: 1; Width: 0.02inch; Min Operating Temperature: -55°C; Length: 1mm; Dielectric: X7R; Voltage Rating: 50V; Number of Pins: 2; Lead Free: Lead Free; Voltage: 50V; Dielectric Material: Ceramic; Height: 0.5mm; Case Code (Metric): 1005; Voltage Rating (DC): 50V; Construction: Flat; Termination: SMD/SMT; Case Code (Imperial): 0402; Depth: 0.5mm; Packaging: Tape and Reel; Mount: Surface Mount; Series: C; RoHS Compliant: Yes; Tolerance: 10%; Case/Package: 0402; Thickness: 0.022inch; Radiation Hardening: No; Resistor Type: Ceramic; REACH SVHC: No SVHC; Part Number: C1005X7R1H473K050BB
R18 = RC0402FR-074K87L: Manufacturer: Yageo / Phycomp; Part Number: RC0402FR-074K87L
R19 = RC0402FR-0739RL: Manufacturer: Yageo / Phycomp; Part Number: RC0402FR-0739RL; Parameter 1: *
R20 = RC0402FR-0780R6L: Manufacturer: Yageo; Part Number: RC0402FR-0780R6L; Parameter 1: *
R21 = RC0402FR-07240RL: 240R 0.063W 1% 0402 (1005 Metric)  SMD; Case-Metric: 1005; Case-EIA: 0402; Power: 0.063 W; Tolerance: 1 %; Technology: SMT; Part Number: RC0402FR-07240RL; Parameter 1: *
RN1-RN6 = TC124-FR-0739RL: Resistor Network; Manufacturer_Name: Yageo Group; Datasheet Link: https://media.digikey.com/pdf/Data%20Sheets/Yageo%20PDFs/YC102-358,TC122-164_Series_DS.pdf; Height: 0.5mm; Part Number: TC124-FR-0739RL; Mouser Part Number: 603-TC124-FR-0739RL; Mouser Price/Stock: https://www.mouser.co.uk/ProductDetail/Yageo/TC124-FR-0739RL?qs=k2KEx2DUIRQSySNVqUaapQ%3D%3D; Arrow Part Number: TC124-FR-0739RL; Arrow Price/Stock: null?region=nac
U8 = MT41K512M8DA-107_IT_P: Integrated Circuit; Manufacturer_Name: Micron; Manufacturer_Part_Number: MT41K512M8DA-107 IT:P; Datasheet Link: https://datasheet.datasheetarchive.com/originals/distributors/DKDS42/DSANUWW0045409.pdf; Height: 1.2mm; Mouser Part Number: 340-265832-TRAY; Mouser Price/Stock: https://www.mouser.co.uk/ProductDetail/Micron/MT41K512M8DA-107-ITP?qs=rrS6PyfT74e6FNRbiIMwlg%3D%3D; Arrow Part Number: MT41K512M8DA-107 IT:P; Arrow Price/Stock: https://www.arrow.com/en/products/mt41k512m8da-107-itp/micron-technology?region=europe
U9 = TPS51206DSQR: Integrated Circuit; Manufacturer_Name: Texas Instruments; Datasheet Link: http://www.ti.com/lit/ds/symlink/tps51206.pdf; Height: 0.8mm; Manufacturer_Part_Number: TPS51206DSQR; Mouser Part Number: 595-TPS51206DSQR; Mouser Price/Stock: https://www.mouser.co.uk/ProductDetail/Texas-Instruments/TPS51206DSQR?qs=%252BG2H6gVb6ixLbD%2FQxTGyiQ%3D%3D; Arrow Part Number: TPS51206DSQR; Arrow Price/Stock: https://www.arrow.com/en/products/tps51206dsqr/texas-instruments?region=nac

## Sheet BANK14.SchDoc: XC7A3G - BANK14
size A4; Date: 9 AUG 2026; Engineer: Parsa Malekpour; Revision: 1.0.0; SheetNumber: 2; SheetTotal: 18
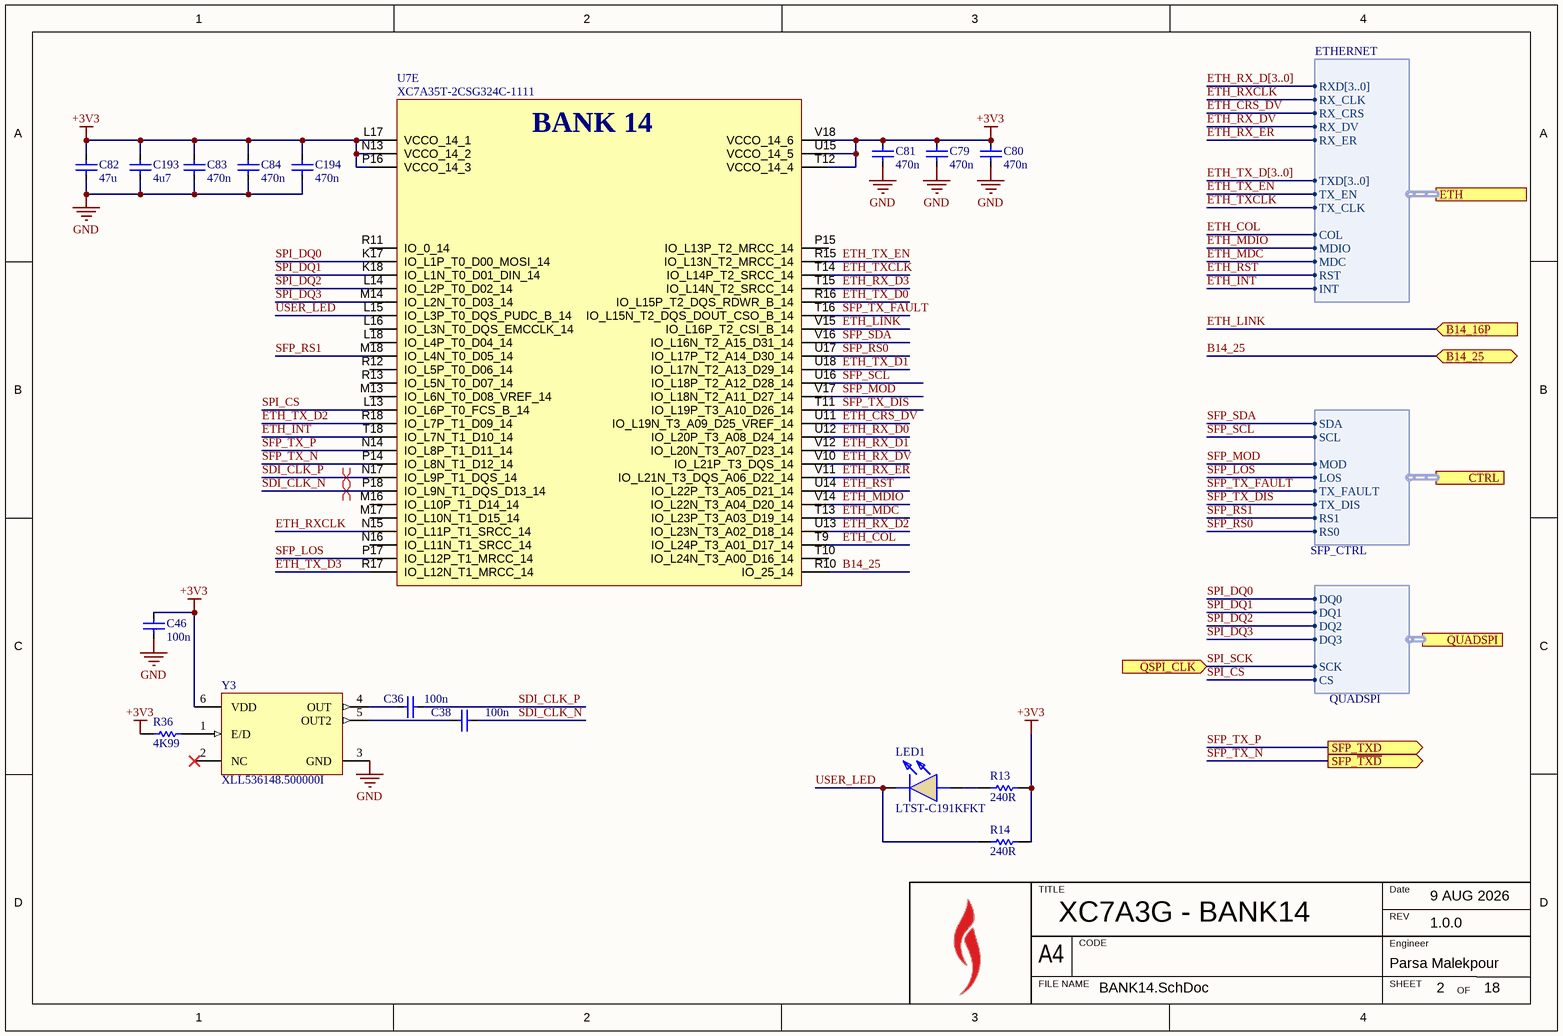
[diagram p3: BANK14.SchDoc]

### Parts
C36  value 100n  [FP-C1005-050-0_05-IPC_C]  (hidden comment: C1005X7R1H104K050BB)
C38  value 100n  [FP-C1005-050-0_05-IPC_C]  (hidden comment: C1005X7R1H104K050BB)
C46  value 100n  [FP-C1005-050-0_05-IPC_C]  (hidden comment: C1005X7R1H104K050BB)
C79  value 470n  [FP-C1005-050-0_05-IPC_C]  (hidden comment: C1005X5R1E474K050BB)
C80  value 470n  [FP-C1005-050-0_05-IPC_C]  (hidden comment: C1005X5R1E474K050BB)
C81  value 470n  [FP-C1005-050-0_05-IPC_C]  (hidden comment: C1005X5R1E474K050BB)
C82  value 47u  [FP-C2012-125-0_2-IPC_C]  (hidden comment: C2012X5R1A476M125AC)
C83  value 470n  [FP-C1005-050-0_05-IPC_C]  (hidden comment: C1005X5R1E474K050BB)
C84  value 470n  [FP-C1005-050-0_05-IPC_C]  (hidden comment: C1005X5R1E474K050BB)
C193  value 4u7  [FP-C1005-050-0_20-0_10-IPC_C]  (hidden comment: C1005X5R1A475K050BE)
C194  value 470n  [FP-C1005-050-0_05-IPC_C]  (hidden comment: C1005X5R1E474K050BB)
LED1  LTST-C191KFKT  [LEDC1608X55N]
R13  value 240R  [RESC1005X40X25LL05T10]  (hidden comment: RC0402FR-07240RL)
R14  value 240R  [RESC1005X40X25LL05T10]  (hidden comment: RC0402FR-07240RL)
R36  value 4K99  [RESC1005X40X25LL05T10]  (hidden comment: RC0402FR-074K99L)
U7  XC7A35T-2CSG324C-1111  [BGA324C80P18X18_1500X1500X150]  (part E of 8)
Y3  XLL536148.500000I  [JS6_MFG]

### Ports
B14_16P (in, see TOP[1B]), B14_25 (bidir, see TOP[1B]), CTRL (harness SFP_CTRL, see TOP[2B], OPTICS[1B]), ETH (harness ETHERNET, see TOP[1C]), QSPI_CLK (in, see TOP[2C]), QUADSPI (harness QUADSPI, see TOP[1C], FLASH[3B]), SFP_TXD (out, see TOP[2B]), SFP_~{TXD} (out, see TOP[2B])

### Harnesses
ETHERNET: RXD[3..0], TXD[3..0], TX_EN, TX_CLK, RX_CLK, RX_CRS, RX_DV, COL, RX_ER, MDIO, MDC, RST, INT
QUADSPI: DQ0, DQ1, DQ2, DQ3, SCK, CS
SFP_CTRL: RS0, RS1, TX_DIS, TX_FAULT, LOS, MOD, SCL, SDA

### Nets
+3V3: C46.2 C79.1 C80.1 C81.1 C82.1 C83.1 C84.1 C193.1 C194.1 R13.2 R14.2 R36.1 U7.L17(VCCO_14_1) U7.N13(VCCO_14_2) U7.P16(VCCO_14_3) U7.T12(VCCO_14_4) U7.U15(VCCO_14_5) U7.V18(VCCO_14_6) Y3.6(VDD)
GND: C46.1 C79.2 C80.2 C81.2 C82.2 C83.2 C84.2 C193.2 C194.2 Y3.3(GND)
B14_25: U7.R10(IO_25_14) ; port B14_25
ETH_COL: U7.T9(IO_L24P_T3_A01_D17_14) ; port ETH.COL
ETH_CRS_DV: U7.U11(IO_L19N_T3_A09_D25_VREF_14) ; port ETH.RX_CRS
ETH_INT: U7.T18(IO_L7N_T1_D10_14) ; port ETH.INT
ETH_LINK: U7.V15(IO_L16P_T2_CSI_B_14) ; port B14_16P
ETH_MDC: U7.T13(IO_L23P_T3_A03_D19_14) ; port ETH.MDC
ETH_MDIO: U7.V14(IO_L22N_T3_A04_D20_14) ; port ETH.MDIO
ETH_RST: U7.U14(IO_L22P_T3_A05_D21_14) ; port ETH.RST
ETH_RX_D0: U7.U12(IO_L20P_T3_A08_D24_14)
ETH_RX_D1: U7.V12(IO_L20N_T3_A07_D23_14)
ETH_RX_D2: U7.U13(IO_L23N_T3_A02_D18_14)
ETH_RX_D3: U7.T15(IO_L14N_T2_SRCC_14)
ETH_RX_DV: U7.V10(IO_L21P_T3_DQS_14) ; port ETH.RX_DV
ETH_RX_ER: U7.V11(IO_L21N_T3_DQS_A06_D22_14) ; port ETH.RX_ER
ETH_RXCLK: U7.N15(IO_L11P_T1_SRCC_14) ; port ETH.RX_CLK
ETH_TX_D0: U7.R16(IO_L15P_T2_DQS_RDWR_B_14)
ETH_TX_D1: U7.U18(IO_L17N_T2_A13_D29_14)
ETH_TX_D2: U7.R18(IO_L7P_T1_D09_14)
ETH_TX_D3: U7.R17(IO_L12N_T1_MRCC_14)
ETH_TX_EN: U7.R15(IO_L13N_T2_MRCC_14) ; port ETH.TX_EN
ETH_TXCLK: U7.T14(IO_L14P_T2_SRCC_14) ; port ETH.TX_CLK
SDI_CLK_N: C38.2 U7.P18(IO_L9N_T1_DQS_D13_14)
SDI_CLK_P: C36.2 U7.N17(IO_L9P_T1_DQS_14)
SFP_LOS: U7.P17(IO_L12P_T1_MRCC_14) ; port CTRL.LOS
SFP_MOD: U7.V17(IO_L18N_T2_A11_D27_14) ; port CTRL.MOD
SFP_RS0: U7.U17(IO_L17P_T2_A14_D30_14) ; port CTRL.RS0
SFP_RS1: U7.M18(IO_L4N_T0_D05_14) ; port CTRL.RS1
SFP_SCL: U7.U16(IO_L18P_T2_A12_D28_14) ; port CTRL.SCL
SFP_SDA: U7.V16(IO_L16N_T2_A15_D31_14) ; port CTRL.SDA  [project net SFP_SCL.SDA]
SFP_TX_DIS: U7.T11(IO_L19P_T3_A10_D26_14) ; port CTRL.TX_DIS  [project net SFP_SCL.TX_DIS]
SFP_TX_FAULT: U7.T16(IO_L15N_T2_DQS_DOUT_CSO_B_14) ; port CTRL.TX_FAULT  [project net SFP_SCL.TX_FAULT]
SFP_TX_N: U7.P14(IO_L8N_T1_D12_14) ; port SFP_~{TXD}
SFP_TX_P: U7.N14(IO_L8P_T1_D11_14) ; port SFP_TXD
SPI_CS: U7.L13(IO_L6P_T0_FCS_B_14) ; port QUADSPI.CS
SPI_DQ0: U7.K17(IO_L1P_T0_D00_MOSI_14) ; port QUADSPI.DQ0
SPI_DQ1: U7.K18(IO_L1N_T0_D01_DIN_14) ; port QUADSPI.DQ1
SPI_DQ2: U7.L14(IO_L2P_T0_D02_14) ; port QUADSPI.DQ2
SPI_DQ3: U7.M14(IO_L2N_T0_D03_14) ; port QUADSPI.DQ3
SPI_SCK: port QSPI_CLK, port QUADSPI.SCK
USER_LED: LED1.1(K) R14.1 U7.L15(IO_L3P_T0_DQS_PUDC_B_14)
NetC36_1: C36.1 Y3.4(OUT)
NetC38_1: C38.1 Y3.5(OUT2)
NetLED1_2: LED1.2(A) R13.1
NetR36_2: R36.2 Y3.1(E/D)

Not connected (* = marked no-connect by the designer): U7 L16(IO_L3N_T0_DQS_EMCCLK_14) L18(IO_L4P_T0_D04_14) M13(IO_L6N_T0_D08_VREF_14) M16(IO_L10P_T1_D14_14) M17(IO_L10N_T1_D15_14) N16(IO_L11N_T1_SRCC_14) P15(IO_L13P_T2_MRCC_14) R11(IO_0_14) R12(IO_L5P_T0_D06_14) R13(IO_L5N_T0_D07_14) T10(IO_L24N_T3_A00_D16_14); Y3 2(NC)*

### Buses and harness runs
bus ETH_RX_D[3..0]
bus ETH_TX_D[3..0]

### Layout directives
differential pair: SDI_CLK_N, SDI_CLK_P

### Notes on the sheet
- TITLE
- REV
- Date
- A4
- FILE NAME
- CODE
- SHEET
- Engineer
- OF
- (in symbol XC7A35T-2CSG324C-1111, part E) BANK 14

### Library data of the parts
C36 C38 C46 = C1005X7R1H104K050BB: as C128 on sheet DDR; Voltage: 50V; Min Operating Temperature: -55°C; Depth: 0.5mm; Radiation Hardening: No; RoHS Compliant: Yes; Voltage Rating (DC): 50V; Lead Free: Lead Free; Resistor Type: Ceramic; Height: 0.5mm; Dielectric: X7R; Thickness: 0.022inch; Case/Package: 0402; Case Code (Metric): 1005; Termination: SMD/SMT; Packaging: Tape and Reel; Max Operating Temperature: 125°C; Mount: Surface Mount; Package Quantity: 1; Width: 0.02inch; Weight: 2.3E-05oz; Voltage Rating: 50V; Tolerance: 10%; Construction: Flat; Case Code (Imperial): 0402; Length: 1mm; REACH SVHC: No SVHC; Series: C; Part Number: C1005X7R1H104K050BB
C79-C81 C83 C84 C194 = C1005X5R1E474K050BB: as C174 on sheet DDR; Dissipation Factor: 10%; Case Code (Metric): 1005; RoHS Compliant: Yes; Lead Free: Lead Free; Length: 1mm; Case/Package: 0402; Termination: SMD/SMT; Dielectric Material: Ceramic; Dielectric: X5R; Depth: 0.5mm; Series: C; Voltage: 25V; Tolerance: 10%; Packaging: Tape and Reel; Resistor Type: Ceramic; Min Operating Temperature: -55°C; Width: 0.02inch; Thickness: 500um; Package Quantity: 10000; Case Code (Imperial): 0402; Construction: Flat; Height: 0.5mm; REACH SVHC: No SVHC; Radiation Hardening: No; Weight: 2.3E-05oz; Mount: Surface Mount; Voltage Rating (DC): 25V; Max Operating Temperature: 85°C; Part Number: C1005X5R1E474K050BB; Voltage Rating: 25V
C82 = C2012X5R1A476M125AC: 47μF ±20% 10V X5R SMD 0805 Multilayer Ceramic Capacitors; RoHS Compliant: Yes; Dielectric: X5R; Case Code (Imperial): 0805; Min Operating Temperature: -55°C; Length: 2mm; Voltage Rating: 10V; Lead Free: Lead Free; Weight: 0.000194oz; Resistor Type: Ceramic; Dielectric Material: Ceramic; Max Operating Temperature: 85°C; Height: 1.25mm; Width: 0.049inch; Depth: 1.25mm; Termination: SMD/SMT; Case/Package: 0805; Voltage Rating (DC): 10V; Voltage: 10V; Thickness: 0.057inch; Tolerance: 20%; REACH SVHC: No SVHC; Package Quantity: 1; Series: C; Case Code (Metric): 2012; Mount: Surface Mount; Packaging: Tape and Reel; Part Number: C2012X5R1A476M125AC
C193 = C1005X5R1A475K050BE: 4.7UF 10V X5R 0402; Tolerance: 10%; Max Operating Temperature: 85°C; Case Code (Metric): 1005; Voltage Rating: 10V; Packaging: Tape and Reel; Case/Package: 0402; Features: Soft Termination; Min Operating Temperature: -55°C; Mount: Surface Mount; Case Code (Imperial): 0402; RoHS Compliant: Yes; Part Number: C1005X5R1A475K050BE
LED1 = LTST-C191KFKT: LED; Manufacturer: Lite-On; Value: Orange; Datasheet Link: https://datasheet.datasheetarchive.com/originals/distributors/Datasheets-305/79307.pdf; Height: 0.55mm; Mouser Part Number: 859-LTST-C191KFKT; Mouser Price/Stock: https://www.mouser.co.uk/ProductDetail/Lite-On/LTST-C191KFKT?qs=1bx9pL%2Fk%252BiAv01YAc0eitQ%3D%3D; Arrow Part Number: LTST-C191KFKT; Arrow Price/Stock: https://www.arrow.com/en/products/ltst-c191kfkt/lite-on-technology.html?utm_currency=USD&region=nac; Part Number: LTST-C191KFKT
R13 R14 = RC0402FR-07240RL: as R21 on sheet DDR; Power: 0.063 W; Tolerance: 1 %; Technology: SMT; Part Number: RC0402FR-07240RL; Parameter 1: *
R36 = RC0402FR-074K99L: Manufacturer: Yageo / Phycomp; Part Number: RC0402FR-074K99L
U7 = XC7A35T-2CSG324C-1111: as U7 on sheet BANK35; Datasheet Link: https://www.xilinx.com/support/documentation/data_sheets/ds181_Artix_7_Data_Sheet.pdf; Height: 1.5mm; Manufacturer_Part_Number: XC7A35T-2CSG324C; Mouser Part Number: 217-XC7A35T-2CSG324C; Mouser Price/Stock: https://www.mouser.co.uk/ProductDetail/AMD-Xilinx/XC7A35T-2CSG324C?qs=rrS6PyfT74fMA9%2F3WtPZmw%3D%3D
Y3 = XLL536148.500000I: Oscillator, 148.5Mhz, Lvds, 5Mm X 3.2Mm Rohs Compliant: Yes; Min Input Voltage: 3.135V; Max Output Frequency: 999.9MHz; Max Input Voltage: 3.465V; ComponentLink1Description: Manufacturer's Website; ComponentLink2Description: Datasheet URL; Mount: Surface Mount; Max Operating Temperature: 85°C; ComponentLink3Description: Manufacturer's Package Drawing; RoHS: Compliant; Number of Pins: 6; ComponentLink2URL: https://octopart.com/cad-content/api/get-model-datasheet/15189/107081581; Output Type: LVDS; Case/Package: CLCC; ComponentLink1URL: http://www.renesas.com; HelpURL: https://octopart.com/cad-content/api/get-model-datasheet/15189/107081581; Min Operating Temperature: -40°C; ComponentLink3URL: https://www.renesas.com/en/document/psc/js6-package-outline-50-x-32-mm-body-11-mm-thick; Height: 1.2mm

## Sheet BANK15.SchDoc: XC7A3G-BANK15
size A4; Date: 9 AUG 2026; Engineer: Parsa Malekpour; Revision: 1.0.0; SheetNumber: 3; SheetTotal: 18
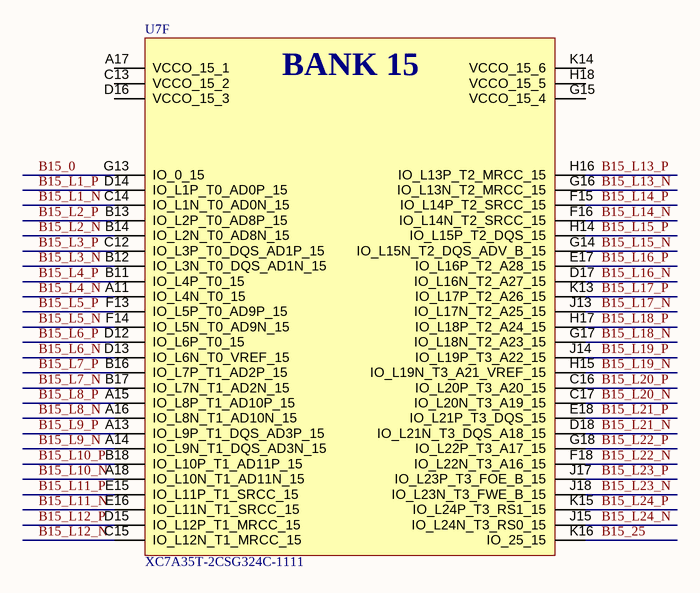
[diagram p4: BANK15.SchDoc]

### Parts
U7  XC7A35T-2CSG324C-1111  [BGA324C80P18X18_1500X1500X150]  (part F of 8)

### Nets
B15_0: U7.G13(IO_0_15)
B15_25: U7.K16(IO_25_15)
B15_L1_N: U7.C14(IO_L1N_T0_AD0N_15)
B15_L1_P: U7.D14(IO_L1P_T0_AD0P_15)
B15_L2_N: U7.B14(IO_L2N_T0_AD8N_15)
B15_L2_P: U7.B13(IO_L2P_T0_AD8P_15)
B15_L3_N: U7.B12(IO_L3N_T0_DQS_AD1N_15)
B15_L3_P: U7.C12(IO_L3P_T0_DQS_AD1P_15)
B15_L4_N: U7.A11(IO_L4N_T0_15)
B15_L4_P: U7.B11(IO_L4P_T0_15)
B15_L5_N: U7.F14(IO_L5N_T0_AD9N_15)
B15_L5_P: U7.F13(IO_L5P_T0_AD9P_15)
B15_L6_N: U7.D13(IO_L6N_T0_VREF_15)
B15_L6_P: U7.D12(IO_L6P_T0_15)
B15_L7_N: U7.B17(IO_L7N_T1_AD2N_15)
B15_L7_P: U7.B16(IO_L7P_T1_AD2P_15)
B15_L8_N: U7.A16(IO_L8N_T1_AD10N_15)
B15_L8_P: U7.A15(IO_L8P_T1_AD10P_15)
B15_L9_N: U7.A14(IO_L9N_T1_DQS_AD3N_15)
B15_L9_P: U7.A13(IO_L9P_T1_DQS_AD3P_15)
B15_L10_N: U7.A18(IO_L10N_T1_AD11N_15)
B15_L10_P: U7.B18(IO_L10P_T1_AD11P_15)
B15_L11_N: U7.E16(IO_L11N_T1_SRCC_15)
B15_L11_P: U7.E15(IO_L11P_T1_SRCC_15)
B15_L12_N: U7.C15(IO_L12N_T1_MRCC_15)
B15_L12_P: U7.D15(IO_L12P_T1_MRCC_15)
B15_L13_N: U7.G16(IO_L13N_T2_MRCC_15)
B15_L13_P: U7.H16(IO_L13P_T2_MRCC_15)
B15_L14_N: U7.F16(IO_L14N_T2_SRCC_15)
B15_L14_P: U7.F15(IO_L14P_T2_SRCC_15)
B15_L15_N: U7.G14(IO_L15N_T2_DQS_ADV_B_15)
B15_L15_P: U7.H14(IO_L15P_T2_DQS_15)
B15_L16_N: U7.D17(IO_L16N_T2_A27_15)
B15_L16_P: U7.E17(IO_L16P_T2_A28_15)
B15_L17_N: U7.J13(IO_L17N_T2_A25_15)
B15_L17_P: U7.K13(IO_L17P_T2_A26_15)
B15_L18_N: U7.G17(IO_L18N_T2_A23_15)
B15_L18_P: U7.H17(IO_L18P_T2_A24_15)
B15_L19_N: U7.H15(IO_L19N_T3_A21_VREF_15)
B15_L19_P: U7.J14(IO_L19P_T3_A22_15)
B15_L20_N: U7.C17(IO_L20N_T3_A19_15)
B15_L20_P: U7.C16(IO_L20P_T3_A20_15)
B15_L21_N: U7.D18(IO_L21N_T3_DQS_A18_15)
B15_L21_P: U7.E18(IO_L21P_T3_DQS_15)
B15_L22_N: U7.F18(IO_L22N_T3_A16_15)
B15_L22_P: U7.G18(IO_L22P_T3_A17_15)
B15_L23_N: U7.J18(IO_L23N_T3_FWE_B_15)
B15_L23_P: U7.J17(IO_L23P_T3_FOE_B_15)
B15_L24_N: U7.J15(IO_L24N_T3_RS0_15)
B15_L24_P: U7.K15(IO_L24P_T3_RS1_15)

Not connected (* = marked no-connect by the designer): U7 A17(VCCO_15_1) C13(VCCO_15_2) D16(VCCO_15_3) G15(VCCO_15_4) H18(VCCO_15_5) K14(VCCO_15_6)

### Notes on the sheet
- TITLE
- REV
- Date
- A4
- FILE NAME
- CODE
- SHEET
- Engineer
- OF
- (in symbol XC7A35T-2CSG324C-1111, part F) BANK 15

### Library data of the parts
U7 = XC7A35T-2CSG324C-1111: as U7 on sheet BANK35; Datasheet Link: https://www.xilinx.com/support/documentation/data_sheets/ds181_Artix_7_Data_Sheet.pdf; Height: 1.5mm; Manufacturer_Part_Number: XC7A35T-2CSG324C; Mouser Part Number: 217-XC7A35T-2CSG324C; Mouser Price/Stock: https://www.mouser.co.uk/ProductDetail/AMD-Xilinx/XC7A35T-2CSG324C?qs=rrS6PyfT74fMA9%2F3WtPZmw%3D%3D